# EAGLE board HIL (EAGLE 6.5.0), part 1 of 2
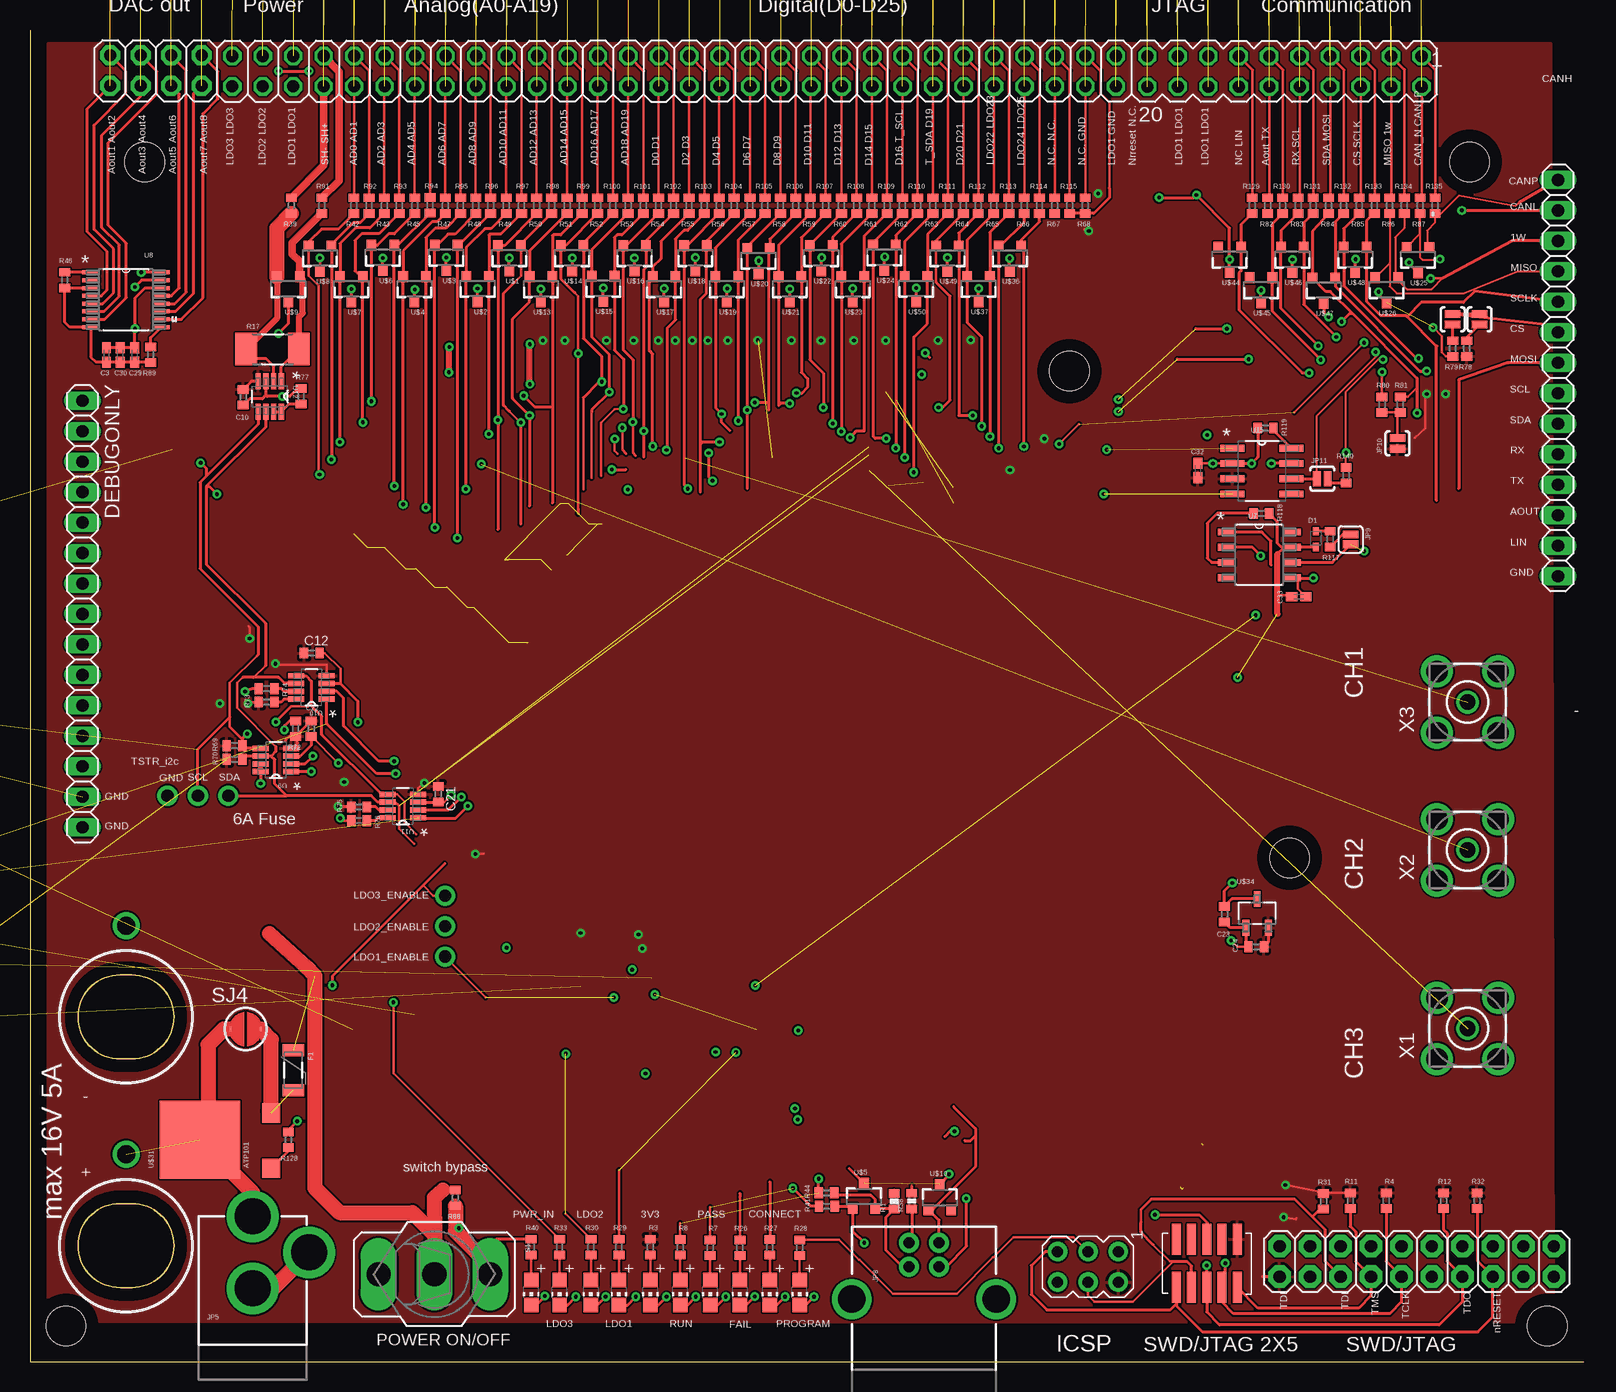
[diagram p7: board, top side]
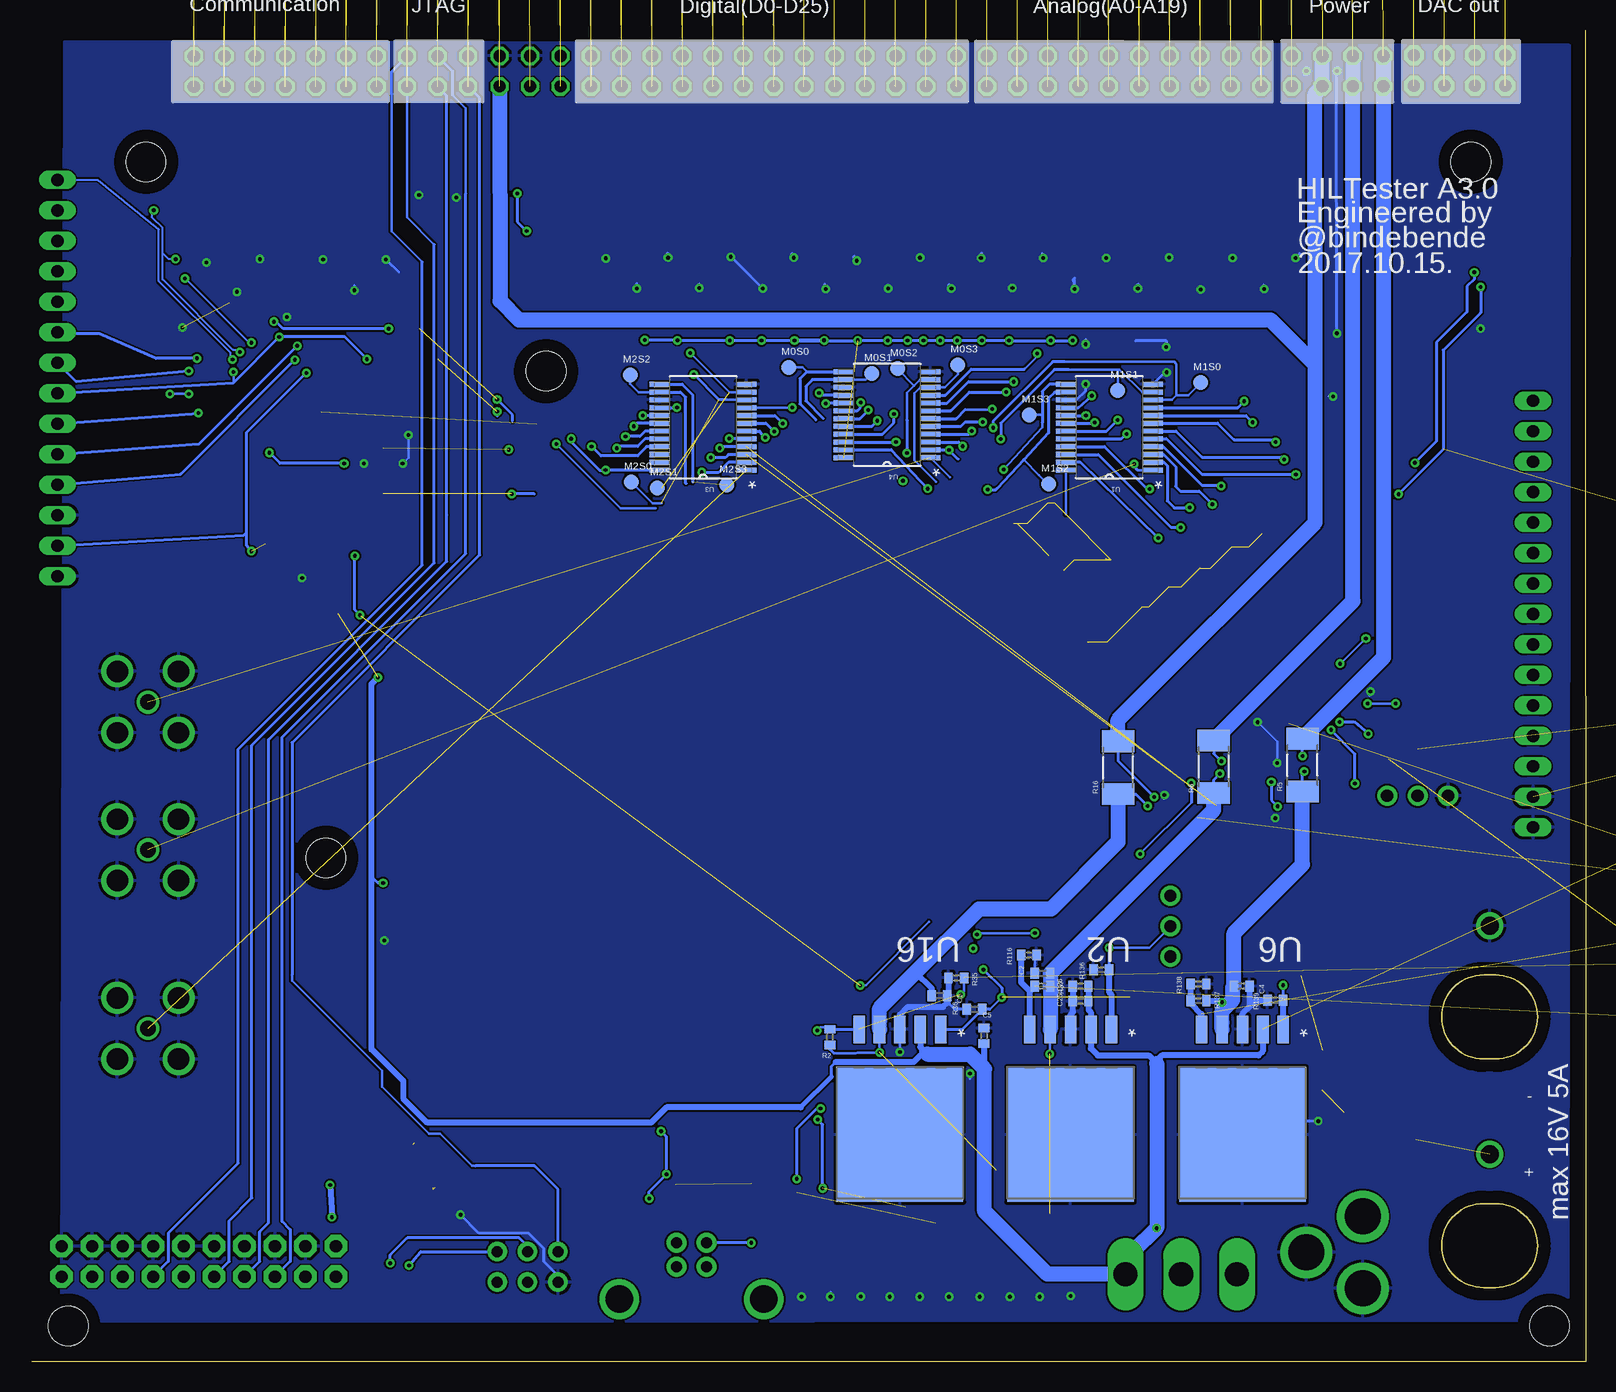
[diagram p8: board, bottom side, seen from below]

Size 129.54 x 111 mm. Coordinates in mm from the lower left corner, seen from the top.
Outline: 129.54,0 0,0 0.03,111
Copper layers (1*16): Top 0.035mm / dielectric 1.5mm / Bottom 0.035mm
Design rules "default *": minimum track width 6mil, minimum drill 12mil, track to track 6mil, track to pad 6mil, pad to pad 6mil, via to via 6mil, smd to smd 6mil, copper to edge 40mil, drill to drill 8mil, minimum pad ring 10mil, minimum via ring 8mil, stop-mask expansion 4mil, vias tented up to drill 0mil, thermal gap 10mil
Net classes: 1 PP: width 0.254 mm; 2 Ethernet: width 0.22 mm, clearance 0.152 mm; 3 digital: width 0.152 mm; 4 analog: width 0.152 mm
tKeepout: 4 lines
bKeepout: 4 lines

## Footprints (pad centres in the part's own frame; a part is rotated, then mirrored left to right if it is on the bottom)
C0402 = smd 0.7 x 0.9: 1 -0.65,0; 2 0.65,0
C0402K = smd 0.925 x 0.74: 1 -0.6,0; 2 0.6,0
SOD523 = smd 0.7 x 0.5: A 0.7,0; C -0.6,0
1X15 = drill 1.016 long: 1 -17.78,0; 2 -15.24,0; 3 -12.7,0; 4 -10.16,0; 5 -7.62,0; 6 -5.08,0; 7 -2.54,0; 8 0,0; 9 2.54,0; 10 5.08,0; 11 7.62,0; 12 10.16,0; 13 12.7,0; 14 15.24,0; 15 17.78,0
PTC-1206-WIDE = smd 1 x 1.8: 1 -1.654,0; 2 1.654,0
AVRISP = drill 0.9 pad 1.626: 1 -1.27,2.54; 2 1.27,2.54; 3 -1.27,0; 4 1.27,0; 5 -1.27,-2.54; 6 1.27,-2.54
CON_2X5_50MIL = smd 0.74 x 2.6: P1 0,0; P2 0,4.008; P3 1.27,0; P4 1.27,4.008; P5 2.54,0; P6 2.54,4.008; P7 3.81,0; P8 3.81,4.008; P9 5.08,0; P10 5.08,4.008
2X10 = drill 1.016 pad 1.88 octagon: 1 -11.43,-1.27; 2 -11.43,1.27; 3 -8.89,-1.27; 4 -8.89,1.27; 5 -6.35,-1.27; 6 -6.35,1.27; 7 -3.81,-1.27; 8 -3.81,1.27; 9 -1.27,-1.27; 10 -1.27,1.27; 11 1.27,-1.27; 12 1.27,1.27; 13 3.81,-1.27; 14 3.81,1.27; 15 6.35,-1.27; 16 6.35,1.27; 17 8.89,-1.27; 18 8.89,1.27; 19 11.43,-1.27; 20 11.43,1.27
1X14 = drill 1.016 long: 1 -16.51,0; 2 -13.97,0; 3 -11.43,0; 4 -8.89,0; 5 -6.35,0; 6 -3.81,0; 7 -1.27,0; 8 1.27,0; 9 3.81,0; 10 6.35,0; 11 8.89,0; 12 11.43,0; 13 13.97,0; 14 16.51,0
SJ_2S-NO = smd 0.635 x 1.27: 1 -0.45,0; 2 0.45,0
POWER_JACK_PTH = drill 2.997 pad 4.318: GND 0,7.7; GNDBREAK 4.7,10.7; PWR 0,13.7
2X30 = drill 1.016 octagon: 1 -38.1,-1.27; 2 -38.1,1.27; 3 -35.56,-1.27; 4 -35.56,1.27; 5 -33.02,-1.27; 6 -33.02,1.27; 7 -30.48,-1.27; 8 -30.48,1.27; 9 -27.94,-1.27; 10 -27.94,1.27; 11 -25.4,-1.27; 12 -25.4,1.27; 13 -22.86,-1.27; 14 -22.86,1.27; 15 -20.32,-1.27; 16 -20.32,1.27; 17 -17.78,-1.27; 18 -17.78,1.27; 19 -15.24,-1.27; 20 -15.24,1.27; 21 -12.7,-1.27; 22 -12.7,1.27; 23 -10.16,-1.27; 24 -10.16,1.27; 25 -7.62,-1.27; 26 -7.62,1.27; 27 -5.08,-1.27; 28 -5.08,1.27; 29 -2.54,-1.27; 30 -2.54,1.27; 31 0,-1.27; 32 0,1.27; 33 2.54,-1.27; 34 2.54,1.27; 35 5.08,-1.27; 36 5.08,1.27; 37 7.62,-1.27; 38 7.62,1.27; 39 10.16,-1.27; 40 10.16,1.27; 41 12.7,-1.27; 42 12.7,1.27; 43 15.24,-1.27; 44 15.24,1.27; 45 17.78,-1.27; 46 17.78,1.27; 47 20.32,-1.27; 48 20.32,1.27; 49 22.86,-1.27; 50 22.86,1.27; 51 25.4,-1.27; 52 25.4,1.27; 53 27.94,-1.27; 54 27.94,1.27; 55 30.48,-1.27; 56 30.48,1.27; 57 33.02,-1.27; 58 33.02,1.27; 59 35.56,-1.27; 60 35.56,1.27
USB-B-PTH = drill 0.914 pad 1.676: D+ 0,1.25; D- 1.981,1.25; GND 0,-1.25; VBUS 1.981,-1.25 | drill 2.286: S1 -2.718,-6.02; S2 -2.718,6.02
SJ_2S = smd 0.635 x 1.27: 1 -0.412,0; 2 0.412,0
BINDING_POST = drill 1.5: P$1 0,7.62
1X03-CLEANBIG = drill 1.016 pad 1.676: 1 -2.54,0; 2 0,0; 3 2.54,0
2X04 = drill 1.016 pad 1.676 octagon: 1 -3.81,-1.27; 2 -3.81,1.27; 3 -1.27,-1.27; 4 -1.27,1.27; 5 1.27,-1.27; 6 1.27,1.27; 7 3.81,-1.27; 8 3.81,1.27
CHIP-LED0805 = smd 1.2 x 1.2: A 0,-1.05; C 0,1.05
B1,27 = smd 1.27 x 1.27: TP 0,0
0402-RES = smd 0.7 x 0.9: 1 -0.65,0; 2 0.65,0
R0402 = smd 0.7 x 0.9: 1 -0.65,0; 2 0.65,0
R5025 = smd 1.8 x 2.7: 1 -2.2,0; 2 2.2,0
1206 = smd 1.6 x 1.8: 1 -1.4,0; 2 1.4,0
320-916 = drill 2.007 long: 1 0,4.648; 2 0,0; 3 0,-4.648
SJ_ROUND = smd 0.152 x 0.305: 1 -1.27,0; 2 1.27,0
STAND-OFF@1 = hole 3.302: 0,0
STAND-OFF = hole 3.302: 0,0
MA10-2 = drill 1.016 octagon: 1 -11.43,-1.27; 2 -11.43,1.27; 3 -8.89,-1.27; 4 -8.89,1.27; 5 -6.35,-1.27; 6 -6.35,1.27; 7 -3.81,-1.27; 8 -3.81,1.27; 9 -1.27,-1.27; 10 -1.27,1.27; 11 1.27,-1.27; 12 1.27,1.27; 13 3.81,-1.27; 14 3.81,1.27; 15 6.35,-1.27; 16 6.35,1.27; 17 8.89,-1.27; 18 8.89,1.27; 19 11.43,-1.27; 20 11.43,1.27
SOP65P780X200-24N = smd 1.651 x 0.432: 1 -3.632,3.581; 2 -3.632,2.921; 3 -3.632,2.286; 4 -3.632,1.626; 5 -3.632,0.965; 6 -3.632,0.33; 7 -3.632,-0.33; 8 -3.632,-0.965; 9 -3.632,-1.626; 10 -3.632,-2.286; 11 -3.632,-2.921; 12 -3.632,-3.581; 13 3.632,-3.581; 14 3.632,-2.921; 15 3.632,-2.286; 16 3.632,-1.626; 17 3.632,-0.965; 18 3.632,-0.33; 19 3.632,0.33; 20 3.632,0.965; 21 3.632,1.626; 22 3.632,2.286; 23 3.632,2.921; 24 3.632,3.581
TO170P1485X457-6N = smd 0.965 x 2.286: 1 -3.404,-8.611; 2 -1.702,-8.611; 3 0,-8.611; 4 1.702,-8.611; 5 3.404,-8.611 | smd 10.541 x 11.227: 6 0,0.152
SOP65P490X110-8N = smd 1.067 x 0.356: 1 -2.134,0.965; 2 -2.134,0.33; 3 -2.134,-0.33; 4 -2.134,-0.965; 5 2.134,-0.965; 6 2.134,-0.33; 7 2.134,0.33; 8 2.134,0.965
SOIC127P600X175-8N = smd 1.473 x 0.559: 1 -2.718,1.905; 2 -2.718,0.635; 3 -2.718,-0.635; 4 -2.718,-1.905; 5 2.718,-1.905; 6 2.718,-0.635; 7 2.718,0.635; 8 2.718,1.905
SOP65P640X120-16N = smd 1.473 x 0.356: 1 -2.921,2.286; 2 -2.921,1.626; 3 -2.921,0.965; 4 -2.921,0.33; 5 -2.921,-0.33; 6 -2.921,-0.965; 7 -2.921,-1.626; 8 -2.921,-2.286; 9 2.921,-2.286; 10 2.921,-1.626; 11 2.921,-0.965; 12 2.921,-0.33; 13 2.921,0.33; 14 2.921,0.965; 15 2.921,1.626; 16 2.921,2.286
SOT65P280X145-8N = smd 1.321 x 0.432: 1 -1.27,0.965; 2 -1.27,0.33; 3 -1.27,-0.33; 4 -1.27,-0.965; 5 1.27,-0.965; 6 1.27,-0.33; 7 1.27,0.33; 8 1.27,0.965
SOIC127P600X175-8N' = smd 1.981 x 0.559: 1 -2.464,1.905; 2 -2.464,0.635; 3 -2.464,-0.635; 4 -2.464,-1.905; 5 2.464,-1.905; 6 2.464,-0.635; 7 2.464,0.635; 8 2.464,1.905
SOT23-3 = smd 0.8 x 0.9: 1 -0.95,-1; 2 0.95,-1; 3 0,1.1
DS3501 = smd 1.524 x 0.33: A0 -4.572,0.279; A1 -4.572,0.762; GND -4.572,1.778; RH -0.508,0.279; RL -0.508,1.27; RW -0.508,0.762; SCL -0.508,2.261; SDA -4.572,2.261; V+ -0.508,1.778; VCC -4.572,1.27
SOT95P290X145-5N = smd 1.27 x 0.559: 1 -1.295,0.94; 2 -1.295,0; 3 -1.295,-0.94; 4 1.295,-0.94; 5 1.295,0.94
STM32F4-DISCOVERY_STM32F4-DISCOVERY = drill 0.8 square: P$1 -26.67,27.94; P$51 24.13,27.94 | drill 0.8: P$2 -24.13,27.94; P$3 -26.67,25.4; P$4 -24.13,25.4; P$5 -26.67,22.86; P$6 -24.13,22.86; P$7 -26.67,20.32; P$8 -24.13,20.32; P$9 -26.67,17.78; P$10 -24.13,17.78; P$11 -26.67,15.24; P$12 -24.13,15.24; P$13 -26.67,12.7; P$14 -24.13,12.7; P$15 -26.67,10.16; P$16 -24.13,10.16; P$17 -26.67,7.62; P$18 -24.13,7.62; P$19 -26.67,5.08; P$20 -24.13,5.08; P$21 -26.67,2.54; P$22 -24.13,2.54; P$23 -26.67,0; P$24 -24.13,0; P$25 -26.67,-2.54; P$26 -24.13,-2.54; P$27 -26.67,-5.08; P$28 -24.13,-5.08; P$29 -26.67,-7.62; P$30 -24.13,-7.62; P$31 -26.67,-10.16; P$32 -24.13,-10.16; P$33 -26.67,-12.7; P$34 -24.13,-12.7; P$35 -26.67,-15.24; P$36 -24.13,-15.24; P$37 -26.67,-17.78; P$38 -24.13,-17.78; P$39 -26.67,-20.32; P$40 -24.13,-20.32; P$41 -26.67,-22.86; P$42 -24.13,-22.86; P$43 -26.67,-25.4; P$44 -24.13,-25.4; P$45 -26.67,-27.94; P$46 -24.13,-27.94; P$47 -26.67,-30.48; P$48 -24.13,-30.48; P$49 -26.67,-33.02; P$50 -24.13,-33.02; P$52 26.67,27.94; P$53 24.13,25.4; P$54 26.67,25.4; P$55 24.13,22.86; P$56 26.67,22.86; P$57 24.13,20.32; P$58 26.67,20.32; P$59 24.13,17.78; P$60 26.67,17.78; P$61 24.13,15.24; P$62 26.67,15.24; P$63 24.13,12.7; P$64 26.67,12.7; P$65 24.13,10.16; P$66 26.67,10.16; P$67 24.13,7.62; P$68 26.67,7.62; P$69 24.13,5.08; P$70 26.67,5.08; P$71 24.13,2.54; P$72 26.67,2.54; P$73 24.13,0; P$74 26.67,0; P$75 24.13,-2.54; P$76 26.67,-2.54; P$77 24.13,-5.08; P$78 26.67,-5.08; P$79 24.13,-7.62; P$80 26.67,-7.62; P$81 24.13,-10.16; P$82 26.67,-10.16; P$83 24.13,-12.7; P$84 26.67,-12.7; P$85 24.13,-15.24; P$86 26.67,-15.24; P$87 24.13,-17.78; P$88 26.67,-17.78; P$89 24.13,-20.32; P$90 26.67,-20.32; P$91 24.13,-22.86; P$92 26.67,-22.86; P$93 24.13,-25.4; P$94 26.67,-25.4; P$95 24.13,-27.94; P$96 26.67,-27.94; P$97 24.13,-30.48; P$98 26.67,-30.48; P$99 24.13,-33.02; P$100 26.67,-33.02
ATPACK = smd 6.5 x 6.7: D 0.04,5.37 | smd 1.6 x 1.5: G -2.315,-0.59; S 2.285,-0.59
SOT95P300X145-3N = smd 0.559 x 1.321: 1 -0.94,-1.194; 2 0.94,-1.194; 3 0,1.194
BU-SMA-V = drill 1.27: 1 0,0 | drill 1.778: 2 -2.55,2.55; 3 2.55,2.55; 4 2.55,-2.55; 5 -2.55,-2.55

## Placement (x,y rotation side)
C1  10uF  [C0402]  53.85,30.53 0 bottom
C2  10uF  [C0402]  45.26,32.38 180 bottom
C3  0.1uF  [C0402K]  6.38,83.92 270 top
C4  10uF  [C0402]  28.65,31.32 0 bottom
C5  10uF  [C0402]  50.14,27.18 90 bottom
C8  0.1uF  [C0402]  -51.56,46.02 180 top  (outside the outline)
C10  0.1uF  [C0402]  17.78,80.39 270 top
C11  0.1uF  [C0402]  -51.84,37.8 180 top  (outside the outline)
C12  0.1uF  [C0402]  23.5,59.08 0 top
C21  0.1uF  [C0402]  34.04,47.32 270 top
C22  0.1uF  [C0402]  23.44,52.78 90 top
C23  1uF 20V  [C0402]  99.57,37.31 270 top
C24  1uF  [C0402]  102.21,34.59 180 top
C25  10uF  [C0402]  42.09,30.07 180 bottom
C26  10uF  [C0402]  42.09,31.32 180 bottom
C27  0.1uF  [C0402]  -51.99,29.49 180 top  (outside the outline)
C28  0.1uF  [C0402K]  -45.34,17.86 270 top  (outside the outline)
C29  1uF  [C0402K]  8.74,83.92 270 top
C30  10uF  [C0402K]  7.52,83.92 270 top
C31  0.1uF  [C0402]  -47.65,56.97 180 top  (outside the outline)
C32  0.1uF 20V  [C0402K]  97.36,74.3 90 top
C33  0.1uF 20V  [C0402K]  105.77,63.78 180 top
D1  [SOD523]  107.19,68.63 270 top
DEBUGONLY  [1X15]  4.37,62.33 270 top
F1  PTCSMD-W  [PTC-1206-WIDE]  21.95,24.31 270 top
ISP1  AVRISP-6  [AVRISP]  88.19,7.92 270 top
J1  JTAG_ARM_10PIN  [CON_2X5_50MIL]  100.63,10.24 180 top
J4  JTAG_ARM_10PIN  [CON_2X5_50MIL]  -36.45,7.09 90 top  (outside the outline)
JP2  [2X10]  115.6,8.38 0 top
JP3  [1X14]  127.38,81.99 270 top
JP4  DUT_CS_MASTER  [SJ_2S-NO]  120.83,86.89 270 top
JP5  POWER_JACKPTH  [POWER_JACK_PTH]  18.57,-1.57 0 top
JP6  [2X30]  54.97,107.57 0 top
JP7  DUT_CS_RecieveAllMSG  [SJ_2S-NO]  118.59,86.89 270 top
JP8  USB-B  [USB-B-PTH]  74.52,7.95 90 top
JP9  [SJ_2S]  110.08,68.55 270 top
JP10  DUT_CS_MASTER  [SJ_2S-NO]  114,76.56 90 top
JP11  [SJ_2S-NO]  107.72,73.61 0 top
JP12  BINDING_POST  [BINDING_POST]  8,9.7 0 top
JP13  BINDING_POST  [BINDING_POST]  8,28.75 0 top
JP16  [1X03-CLEANBIG]  14,47.19 0 top
JP17  [2X04]  10.49,107.62 0 top
JP18  [1X03-CLEANBIG]  34.59,36.32 90 top
JP19  [2X04]  10.52,117.68 0 top  (outside the outline)
JP20  [2X30]  54.99,117.73 0 top  (outside the outline)
LED1  [CHIP-LED0805]  56.69,5.79 180 top
LED2  [CHIP-LED0805]  54.2,5.79 180 top
LED3  [CHIP-LED0805]  59.18,5.79 180 top
LED4  [CHIP-LED0805]  61.67,5.79 180 top
LED5  [CHIP-LED0805]  64.16,5.79 180 top
LED6  [CHIP-LED0805]  49.1,5.79 180 top
LED7  [CHIP-LED0805]  46.76,5.79 180 top
LED8  [CHIP-LED0805]  44.15,5.79 180 top
LED9  [CHIP-LED0805]  51.71,5.79 180 top
LED10  [CHIP-LED0805]  41.78,5.79 180 top
M0S0  TPB1,27  [B1,27]  66.42,82.88 0 bottom
M0S1  TPB1,27  [B1,27]  59.51,82.37 0 bottom
M0S2  TPB1,27  [B1,27]  57.35,82.78 0 bottom
M0S3  TPB1,27  [B1,27]  52.32,83.08 0 bottom
M1S0  M0S3  [B1,27]  32.08,81.61 0 bottom
M1S1  M0S3  [B1,27]  38.99,80.95 0 bottom
M1S2  M0S3  [B1,27]  44.75,73.15 0 bottom
M1S3  M0S3  [B1,27]  46.38,78.92 0 bottom
M2S0  M0S3  [B1,27]  79.53,73.33 0 bottom
M2S1  M0S3  [B1,27]  77.37,72.85 0 bottom
M2S2  M0S3  [B1,27]  79.63,82.25 0 bottom
M2S3  M0S3  [B1,27]  71.58,73.08 0 bottom
R1  22R  [0402-RES]  72.03,13.39 90 top
R2  [R0402]  62.99,27.08 270 bottom
R3  100R  [R0402]  51.71,9.58 90 top
R4  4k7  [R0402]  113.06,13.44 90 top
R5  [R5025]  23.6,49.73 90 bottom
R6  [R5025]  30.99,49.61 90 bottom
R7  100R  [R0402]  56.69,9.53 90 top
R8  100R  [R0402]  54.2,9.55 90 top
R9  4.7k  [R0402]  -30.96,4.72 270 top  (outside the outline)
R10  4.7k  [R0402]  -24.64,19.53 90 top  (outside the outline)
R11  4k7  [R0402]  110.06,13.44 90 top
R12  4k7  [R0402]  117.83,13.44 90 top
R13  4.7k  [R0402]  -32.26,4.75 270 top  (outside the outline)
R14  4.7k  [R0402]  -33.93,4.75 270 top  (outside the outline)
R15  4.7k  [R0402]  -29.41,8.94 0 top  (outside the outline)
R16  [R5025]  38.96,49.53 90 bottom
R17  [R5025]  20.22,84.4 0 top
R26  100R  [R0402]  59.18,9.53 90 top
R27  100R  [R0402]  61.67,9.55 90 top
R28  100R  [R0402]  64.16,9.53 90 top
R29  100R  [R0402]  49.1,9.58 90 top
R30  100R  [R0402]  46.76,9.58 90 top
R31  4k7  [R0402]  107.82,13.39 90 top
R32  4k7  [R0402]  120.62,13.44 90 top
R33  100R  [R0402]  44.15,9.58 90 top
R34  4k7  [R0402]  -56.92,25.12 270 top  (outside the outline)
R35  [R0402]  52.45,32 0 bottom
R36  4k7  [R0402]  50.93,29.39 180 bottom
R37  [R0402]  45.26,31.32 0 bottom
R38  22R  [0402-RES]  73.51,13.41 90 top
R39  200R  [R0402]  21.79,96.37 270 top
R40  100R  [R0402]  41.78,9.58 90 top
R41  0R  [R0402]  66.42,12.98 180 top
R42  200R  [R0402]  27,96.37 270 top
R43  200R  [R0402]  29.54,96.37 270 top
R44  0R  [R0402]  66.4,14.1 180 top
R45  200R  [R0402]  32.08,96.37 270 top
R46  4k7  [R0402]  2.89,90.16 90 top
R47  200R  [R0402]  34.62,96.37 270 top
R48  200R  [R0402]  37.16,96.37 270 top
R49  200R  [R0402]  39.7,96.37 270 top
R50  200R  [R0402]  42.24,96.37 270 top
R51  200R  [R0402]  44.78,96.37 270 top
R52  200R  [R0402]  47.32,96.37 270 top
R53  200R  [R0402]  49.86,96.37 270 top
R54  200R  [R0402]  52.4,96.37 270 top
R55  200R  [R0402]  54.94,96.37 270 top
R56  200R  [R0402]  57.45,96.37 270 top
R57  200R  [R0402]  60.02,96.37 270 top
R58  200R  [R0402]  62.56,96.37 270 top
R59  200R  [R0402]  65.05,96.37 270 top
R60  200R  [R0402]  67.64,96.37 270 top
R61  200R  [R0402]  70.18,96.37 270 top
R62  200R  [R0402]  72.72,96.37 270 top
R63  200R  [R0402]  75.26,96.37 270 top
R64  200R  [R0402]  77.8,96.37 270 top
R65  200R  [R0402]  80.34,96.37 270 top
R66  200R  [R0402]  82.88,96.37 270 top
R67  200R  [R0402]  85.42,96.37 270 top
R68  200R  [R0402]  87.96,96.37 270 top
R69  4.7k  [R0402]  17.04,51.36 180 top
R70  4.7k  [R0402]  17.04,50.22 180 top
R72  4k7  [R0402]  22.15,52.78 270 top
R73  4k7  [R0402]  19.71,54.99 180 top
R74  4k7  [R0402]  19.71,56.11 0 top
R75  4k7  [R0402]  27.43,46.25 180 top
R76  4k7  [R0402]  27.43,45.11 0 top
R77  4k7  [R0402]  22.61,80.47 90 top
R78  4.7k  [R0402]  119.76,84.45 270 top
R79  4.7k  [R0402]  118.59,84.45 270 top
R80  4.7k  [R0402]  112.7,79.78 90 top
R81  4.7k  [R0402]  114.22,79.78 90 top
R82  200R  [R0402]  103.17,96.37 270 top
R83  200R  [R0402]  105.71,96.37 270 top
R84  200R  [R0402]  108.25,96.37 270 top
R85  200R  [R0402]  110.79,96.37 270 top
R86  200R  [R0402]  113.33,96.37 270 top
R87  200R  [R0402]  115.87,96.37 270 top
R88  0R  [R0402]  35.46,13.67 270 top
R89  4k7  [R0402]  10.06,83.95 270 top
R90  4k7  [R0402]  -55.73,25.12 270 top  (outside the outline)
R91  200R  [R0402]  24.33,96.37 90 top
R92  200R  [R0402]  28.27,96.37 90 top
R93  200R  [R0402]  30.78,96.37 90 top
R94  200R  [R0402]  33.35,96.39 90 top
R95  200R  [R0402]  35.89,96.37 90 top
R96  200R  [R0402]  38.4,96.37 90 top
R97  200R  [R0402]  40.97,96.37 90 top
R98  200R  [R0402]  43.48,96.37 90 top
R99  200R  [R0402]  46.02,96.37 90 top
R100  200R  [R0402]  48.59,96.37 90 top
R101  200R  [R0402]  51.13,96.37 90 top
R102  200R  [R0402]  53.64,96.37 90 top
R103  200R  [R0402]  56.21,96.37 90 top
R104  200R  [R0402]  58.7,96.37 90 top
R105  200R  [R0402]  61.26,96.37 90 top
R106  200R  [R0402]  63.83,96.37 90 top
R107  200R  [R0402]  66.32,96.37 90 top
R108  200R  [R0402]  68.91,96.37 90 top
R109  200R  [R0402]  71.45,96.37 90 top
R110  200R  [R0402]  73.99,96.37 90 top
R111  200R  [R0402]  76.53,96.37 90 top
R112  200R  [R0402]  79.04,96.37 90 top
R113  200R  [R0402]  81.61,96.37 90 top
R114  200R  [R0402]  84.15,96.37 90 top
R115  200R  [R0402]  86.66,96.37 90 top
R116  [R0402]  46.41,33.91 180 bottom
R117  1k  [R0402]  108.38,68.58 270 top
R118  4k7  [R0402]  102.64,70.71 0 top
R119  4k7  [R0402]  103,77.83 0 top
R120  4k7  [R0402]  -57.05,32.51 270 top  (outside the outline)
R121  4k7  [R0402]  -55.73,32.54 270 top  (outside the outline)
R122  4k7  [R0402]  -57.38,40.69 270 top  (outside the outline)
R123  4k7  [R0402]  -55.88,40.69 270 top  (outside the outline)
R124  4k  [R0402]  -47.73,62.92 180 top  (outside the outline)
R125  24k  [R0402]  -47.7,61.75 180 top  (outside the outline)
R126  10k  [R0402]  -59.44,59.99 180 top  (outside the outline)
R127  33k NTC  [1206]  -59.39,57.56 0 top  (outside the outline)
R128  100k  [R0402]  21.54,18.52 270 top
R129  200R  [R0402]  101.88,96.37 90 top
R130  200R  [R0402]  104.42,96.37 90 top
R131  200R  [R0402]  106.96,96.37 90 top
R132  200R  [R0402]  109.5,96.37 90 top
R133  200R  [R0402]  112.06,96.37 90 top
R134  200R  [R0402]  114.55,96.37 90 top
R135  200R  [R0402]  117.12,96.37 90 top
R136  4k7  [R0402]  40.36,32.69 180 bottom
R137  [R0402]  32.26,30.1 0 bottom
R138  [R0402]  32.26,31.5 180 bottom
R139  4k7  [R0402]  25.86,30.15 180 bottom
R140  120  [R0402]  109.7,73.89 90 top
S1  [320-916]  33.71,7.32 270 top
SJ1  [SJ_ROUND]  -46.38,34.04 0 top  (outside the outline)
SJ2  [SJ_ROUND]  -46.02,26.72 0 top  (outside the outline)
SJ3  [SJ_ROUND]  -46.56,42.09 0 top  (outside the outline)
SJ4  [SJ_ROUND]  17.98,27.74 0 top
STANDOFF1  STAND-OFF  [STAND-OFF@1]  3,3 0 top
STANDOFF2  STAND-OFF  [STAND-OFF]  120,100 0 top
STANDOFF3  STAND-OFF  [STAND-OFF]  9.57,100 0 top
STANDOFF4  STAND-OFF  [STAND-OFF]  105,42 0 top
STANDOFF5  STAND-OFF  [STAND-OFF@1]  86.64,82.58 0 top
STANDOFF6  STAND-OFF  [STAND-OFF]  126.47,3 0 top
SV1  [MA10-2]  104.57,107.54 180 top
SV2  [MA10-2]  104.52,117.75 180 top  (outside the outline)
U1  CD74HC4067SM96  [SOP65P780X200-24N]  39.7,77.9 180 bottom
U2  TL1963AKTTR.  [TO170P1485X457-6N]  42.93,19.1 180 bottom
U3  CD74HC4067SM96  [SOP65P780X200-24N]  73.56,77.9 180 bottom
U4  CD74HC4067SM96  [SOP65P780X200-24N]  58.22,78.94 180 bottom
U5  MAX11647EUA+T  [SOP65P490X110-8N]  -47.6,59.31 0 top  (outside the outline)
U6  TL1963AKTTR.  [TO170P1485X457-6N]  28.6,19.1 180 bottom
U7  MCP2003-E/SN  [SOIC127P600X175-8N]  102.46,67.26 0 top
U8  DAC7578SPW  [SOP65P640X120-16N]  8,88.52 0 top
U9  INA219AIDCNR  [SOT65P280X145-8N]  20.5,50.16 180 top
U10  INA219AIDCNR  [SOT65P280X145-8N]  23.47,56.21 180 top
U11  INA219AIDCNR  [SOT65P280X145-8N]  31.09,46.33 180 top
U12  INA219AIDCNR  [SOT65P280X145-8N]  19.99,80.47 270 top
U15  SN65HVD230D  [SOIC127P600X175-8N']  102.69,74.24 0 top
U16  TL1963AKTTR.  [TO170P1485X457-6N]  57.15,19.1 180 bottom
U$1  zener_3.3V  [SOT23-3]  39.95,92.02 180 top
U$2  zener_3.3V  [SOT23-3]  37.31,89.46 180 top
U$3  zener_3.3V  [SOT23-3]  34.7,92.05 180 top
U$4  zener_3.3V  [SOT23-3]  32.05,89.43 180 top
U$5  zener_3.3V  [SOT23-3]  69.52,13.79 0 top
U$6  zener_3.3V  [SOT23-3]  29.41,92.05 180 top
U$7  zener_3.3V  [SOT23-3]  26.8,89.43 180 top
U$8  zener_3.3V  [SOT23-3]  24.18,92 180 top
U$9  zener_3.3V  [SOT23-3]  21.54,89.43 180 top
U$10  zener_3.3V  [SOT23-3]  75.84,13.69 0 top
U$11  DS3501  [DS3501]  -49.3,33.27 0 top  (outside the outline)
U$12  DS3501  [DS3501]  -49.3,25.96 0 top  (outside the outline)
U$13  zener_3.3V  [SOT23-3]  42.6,89.43 180 top
U$14  zener_3.3V  [SOT23-3]  45.19,92.02 180 top
U$15  zener_3.3V  [SOT23-3]  47.78,89.48 180 top
U$16  zener_3.3V  [SOT23-3]  50.39,92.02 180 top
U$17  zener_3.3V  [SOT23-3]  52.86,89.43 180 top
U$18  zener_3.3V  [SOT23-3]  55.47,92.02 180 top
U$19  zener_3.3V  [SOT23-3]  58.09,89.43 180 top
U$20  zener_3.3V  [SOT23-3]  60.73,91.8 180 top
U$21  zener_3.3V  [SOT23-3]  63.35,89.43 180 top
U$22  zener_3.3V  [SOT23-3]  65.96,92.02 180 top
U$23  zener_3.3V  [SOT23-3]  68.58,89.43 180 top
U$24  zener_3.3V  [SOT23-3]  71.22,92.08 180 top
U$25  zener_3.3V  [SOT23-3]  115.7,91.87 180 top
U$26  zener_3.3V  [SOT23-3]  113.08,89.36 180 top
U$27  DS3501  [DS3501]  -49.3,41.33 0 top  (outside the outline)
U$28  24AA04T-I/OT  [SOT95P290X145-5N]  -48.44,18.19 0 top  (outside the outline)
U$29  3v3  [SOT23-3]  -53.26,57.53 0 top  (outside the outline)
U$30  STM32F4-DISCOVERY_STM32F4-DISCOVERY  [STM32F4-DISCOVERY_STM32F4-DISCOVERY]  198.58,60.17 270 top  (outside the outline)
U$31  ATP101  [ATPACK]  19.53,18.47 90 top
U$34  MCP1703T-3302E/CB  [SOT95P300X145-3N]  102.29,37.39 0 top
U$36  zener_3.3V  [SOT23-3]  81.69,92 180 top
U$37  zener_3.3V  [SOT23-3]  79.07,89.46 180 top
U$44  zener_3.3V  [SOT23-3]  100,91.9 180 top
U$45  zener_3.3V  [SOT23-3]  102.62,89.36 180 top
U$46  zener_3.3V  [SOT23-3]  105.23,91.9 180 top
U$47  zener_3.3V  [SOT23-3]  107.85,89.33 180 top
U$48  zener_3.3V  [SOT23-3]  110.46,91.9 180 top
U$49  zener_3.3V  [SOT23-3]  76.48,92 180 top
U$50  zener_3.3V  [SOT23-3]  73.86,89.46 180 top
X1  BU-SMA-V  [BU-SMA-V]  119.84,27.79 90 top
X2  BU-SMA-V  [BU-SMA-V]  119.84,42.67 90 top
X3  BU-SMA-V  [BU-SMA-V]  119.84,54.99 90 top